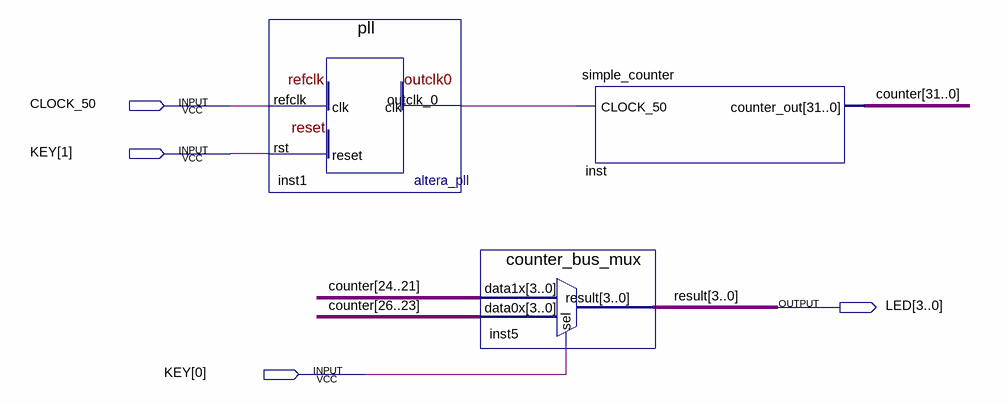
[diagram p0: schematic sheet]
// Quartus schematic my_first_fpga.1.bdf as structural Verilog: 3 symbols, 4 pins
module \my_first_fpga.1  (
  input  CLOCK_50,
  input  [1:0] KEY,
  output [3:0] LED
);

  wire inst1_outclk_0;
  wire [31:0] counter;

  pll inst1 (.refclk(CLOCK_50), .rst(KEY[1]), .outclk_0(inst1_outclk_0));
  counter_bus_mux inst5 (.data1x(counter[24:21]), .data0x(counter[26:23]), .sel(KEY[0]), .result(LED));
  simple_counter inst (.CLOCK_50(inst1_outclk_0), .counter_out(counter));

  // Other names for the same wires on the sheet: result[3:0] = LED
endmodule
